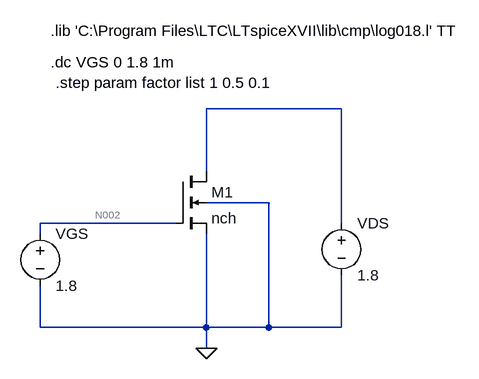
[diagram p0: schematic Week1_Ex1C.asc]
Week1_Ex1C.asc, the LTspice schematic file:
Version 4
SHEET 1 880 680
WIRE 416 240 208 240
WIRE 208 336 208 240
WIRE 304 384 208 384
WIRE 160 416 -48 416
WIRE 416 416 416 240
WIRE -48 432 -48 416
WIRE -48 576 -48 512
WIRE 208 576 208 432
WIRE 208 576 -48 576
WIRE 304 576 304 384
WIRE 304 576 208 576
WIRE 416 576 416 496
WIRE 416 576 304 576
WIRE 208 608 208 576
FLAG 208 608 0
SYMBOL nmos4 160 336 R0
SYMATTR InstName M1
SYMATTR Value nch
SYMATTR Value2 l={factor*2u} w={factor*4u}
SYMBOL voltage -48 416 R0
WINDOW 123 0 0 Left 0
WINDOW 39 0 0 Left 0
SYMATTR InstName VGS
SYMATTR Value 1.8
SYMBOL voltage 416 400 R0
WINDOW 123 0 0 Left 0
WINDOW 39 0 0 Left 0
SYMATTR InstName VDS
SYMATTR Value 1.8
TEXT -32 120 Left 2 !.lib 'C:\\Program Files\\LTC\\LTspiceXVII\\lib\\cmp\\log018.l' TT
TEXT -32 168 Left 2 !.dc VGS 0 1.8 1m
TEXT -24 200 Left 2 !.step param factor list 1 0.5 0.1

The netlist it stands for:
* Week1_Ex1C.asc
M1 N001 N002 0 0 nch l={factor*2u} w={factor*4u}
VGS N002 0 1.8
VDS N001 0 1.8
.model NMOS NMOS
.model PMOS PMOS
.lib standard.mos
.lib 'C:\Program Files\LTC\LTspiceXVII\lib\cmp\log018.l' TT
.dc VGS 0 1.8 1m
.step param factor list 1 0.5 0.1
.backanno
.end

* Results of the author's LTspice run, read from the files saved beside the schematic
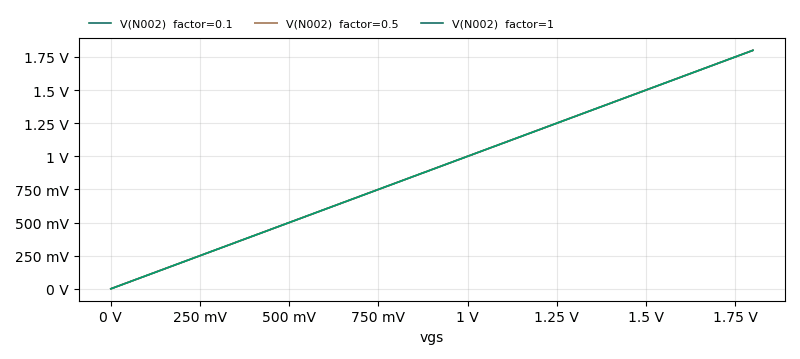
[diagram p1: DC transfer characteristic of Week1_Ex1C.asc, plotted from the saved traces]
* DC transfer characteristic, 3 runs:
*   V(N002) [factor=0.1]: 0 V at vgs=0 V, 1.8 V at vgs=1.8 V, min 0 V, max 1.8 V
*   V(N002) [factor=0.5]: 0 V at vgs=0 V, 1.8 V at vgs=1.8 V, min 0 V, max 1.8 V
*   V(N002) [factor=1]: 0 V at vgs=0 V, 1.8 V at vgs=1.8 V, min 0 V, max 1.8 V